# EAGLE schematic TLC5971 (EAGLE 6.4)
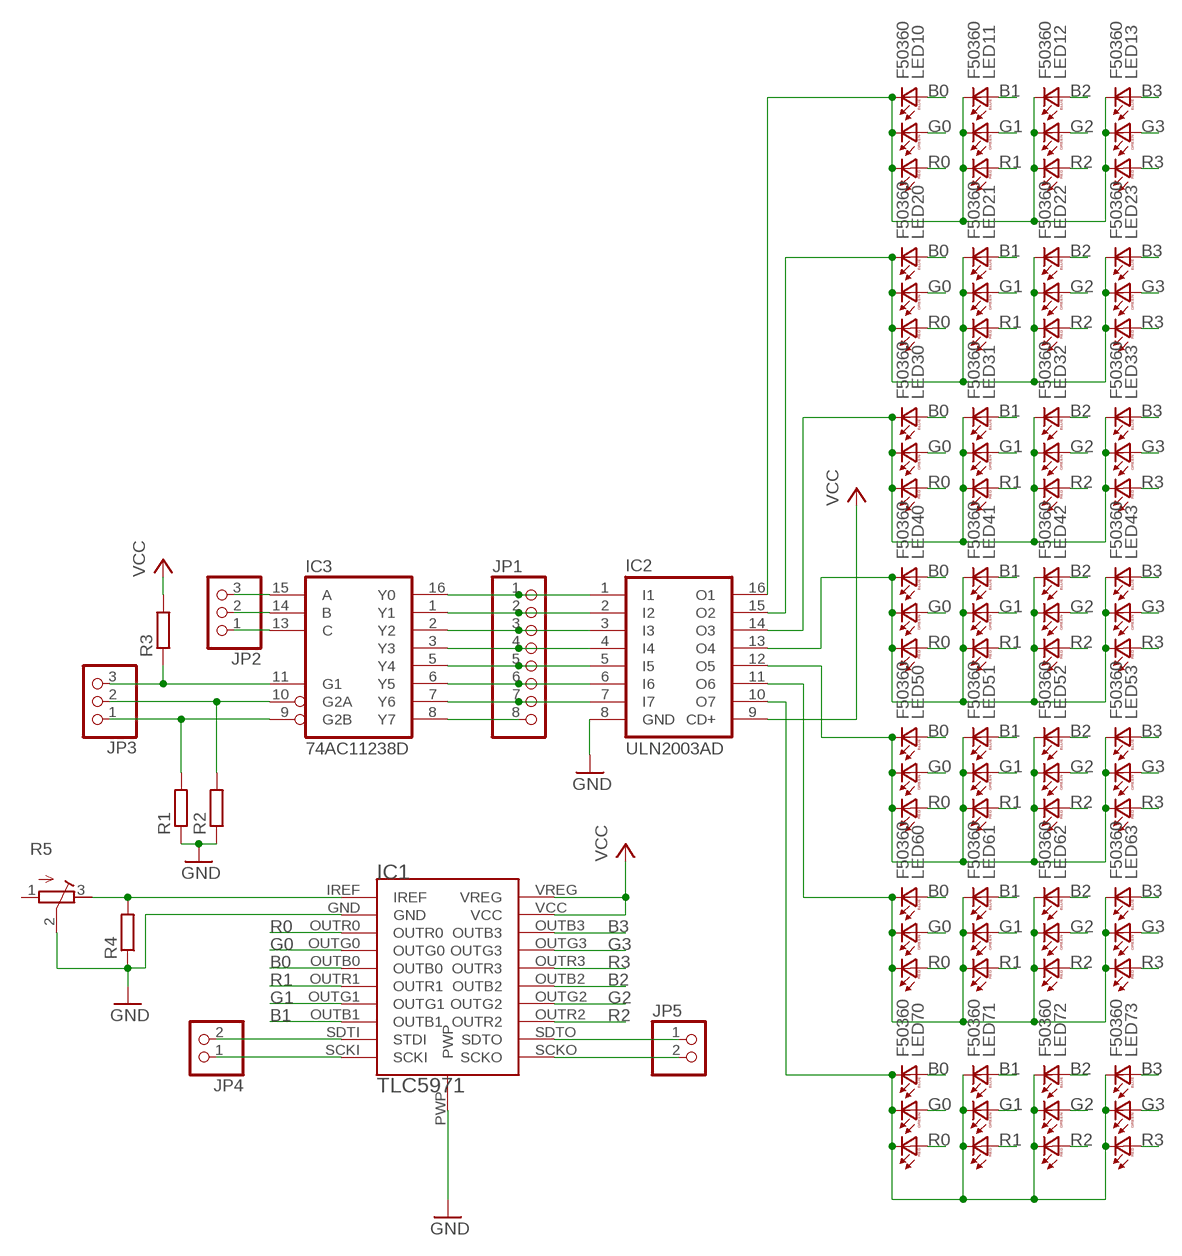
[diagram p0: schematic, sheet 1]

## Parts
IC1  TLC5971  [HTSSOP-20(PWP)]
IC2  ULN2003AD  [SO16]
IC3  74AC11238D  [SO16]
JP1  PINHD-1X8  [1X08]
JP2  PINHD-1X3  [1X03]
JP3  PINHD-1X3  [1X03]
JP4  PINHD-1X2  [1X02]
JP5  PINHD-1X2  [1X02]
LED10  F50360  [F50360]
LED11  F50360  [F50360]
LED12  F50360  [F50360]
LED13  F50360  [F50360]
LED20  F50360  [F50360]
LED21  F50360  [F50360]
LED22  F50360  [F50360]
LED23  F50360  [F50360]
LED30  F50360  [F50360]
LED31  F50360  [F50360]
LED32  F50360  [F50360]
LED33  F50360  [F50360]
LED40  F50360  [F50360]
LED41  F50360  [F50360]
LED42  F50360  [F50360]
LED43  F50360  [F50360]
LED50  F50360  [F50360]
LED51  F50360  [F50360]
LED52  F50360  [F50360]
LED53  F50360  [F50360]
LED60  F50360  [F50360]
LED61  F50360  [F50360]
LED62  F50360  [F50360]
LED63  F50360  [F50360]
LED70  F50360  [F50360]
LED71  F50360  [F50360]
LED72  F50360  [F50360]
LED73  F50360  [F50360]
R1  R-EU_M0805  [M0805]
R2  R-EU_M0805  [M0805]
R3  R-EU_M0805  [M0805]
R4  R-EU_M0805  [M0805]
R5  R-TRIMM74W  [RTRIM74W]

## Nets
B0: IC1.OUTB0 LED10.BA LED20.BA LED30.BA LED40.BA LED50.BA LED60.BA LED70.BA
B1: IC1.OUTB1 LED11.BA LED21.BA LED31.BA LED41.BA LED51.BA LED61.BA LED71.BA
B2: IC1.OUTB2 LED12.BA LED22.BA LED32.BA LED42.BA LED52.BA LED62.BA LED72.BA
B3: IC1.OUTB3 LED13.BA LED23.BA LED33.BA LED43.BA LED53.BA LED63.BA LED73.BA
G0: IC1.OUTG0 LED10.GA LED20.GA LED30.GA LED40.GA LED50.GA LED60.GA LED70.GA
G1: IC1.OUTG1 LED11.GA LED21.GA LED31.GA LED41.GA LED51.GA LED61.GA LED71.GA
G2: IC1.OUTG2 LED12.GA LED22.GA LED32.GA LED42.GA LED52.GA LED62.GA LED72.GA
G3: IC1.OUTG3 LED13.GA LED23.GA LED33.GA LED43.GA LED53.GA LED63.GA LED73.GA
GND: IC1.GND IC1.PWP IC2.8(GND) R1.1 R2.1 R4.1 R5.2(S)
N$1: IC2.1(I1) IC3.16(Y0) JP1.1
N$2: IC2.2(I2) IC3.1(Y1) JP1.2
N$3: IC2.3(I3) IC3.2(Y2) JP1.3
N$4: IC2.4(I4) IC3.3(Y3) JP1.4
N$5: IC2.5(I5) IC3.5(Y4) JP1.5
N$6: IC2.6(I6) IC3.6(Y5) JP1.6
N$7: IC2.7(I7) IC3.7(Y6) JP1.7
N$8: IC3.8(Y7) JP1.8
N$9: IC3.9(G2B) JP3.1 R1.2
N$10: IC3.10(G2A) JP3.2 R2.2
N$11: IC3.11(G1) JP3.3 R3.1
N$12: IC3.15(A) JP2.3
N$13: IC3.14(B) JP2.2
N$14: IC3.13(C) JP2.1
N$15: IC2.12(O5) LED50.BC LED50.GC LED50.RC LED51.BC LED51.GC LED51.RC LED52.BC LED52.GC LED52.RC LED53.BC LED53.GC LED53.RC
N$16: IC2.11(O6) LED60.BC LED60.GC LED60.RC LED61.BC LED61.GC LED61.RC LED62.BC LED62.GC LED62.RC LED63.BC LED63.GC LED63.RC
N$17: IC2.10(O7) LED70.BC LED70.GC LED70.RC LED71.BC LED71.GC LED71.RC LED72.BC LED72.GC LED72.RC LED73.BC LED73.GC LED73.RC
N$18: IC2.13(O4) LED40.BC LED40.GC LED40.RC LED41.BC LED41.GC LED41.RC LED42.BC LED42.GC LED42.RC LED43.BC LED43.GC LED43.RC
N$19: IC2.14(O3) LED30.BC LED30.GC LED30.RC LED31.BC LED31.GC LED31.RC LED32.BC LED32.GC LED32.RC LED33.BC LED33.GC LED33.RC
N$20: IC2.15(O2) LED20.BC LED20.GC LED20.RC LED21.BC LED21.GC LED21.RC LED22.BC LED22.GC LED22.RC LED23.BC LED23.GC LED23.RC
N$21: IC2.16(O1) LED10.BC LED10.GC LED10.RC LED11.BC LED11.GC LED11.RC LED12.BC LED12.GC LED12.RC LED13.BC LED13.GC LED13.RC
N$22: IC1.SDTI(STDI) JP4.2
N$23: IC1.SCKI JP4.1
N$24: IC1.SCKO JP5.2
N$25: IC1.SDTO JP5.1
N$26: IC1.IREF R4.2 R5.3(E)
R0: IC1.OUTR0 LED10.RA LED20.RA LED30.RA LED40.RA LED50.RA LED60.RA LED70.RA
R1: IC1.OUTR1 LED11.RA LED21.RA LED31.RA LED41.RA LED51.RA LED61.RA LED71.RA
R2: IC1.OUTR2 LED12.RA LED22.RA LED32.RA LED42.RA LED52.RA LED62.RA LED72.RA
R3: IC1.OUTR3 LED13.RA LED23.RA LED33.RA LED43.RA LED53.RA LED63.RA LED73.RA
VCC: IC1.VCC IC1.VREG IC2.9(CD+) R3.2
Unconnected: R5.1(A)

## Power pins joined to a net without a drawn wire
GND: IC3.4(GND)
VCC: IC3.12(VCC)

## Library data of the parts
IC1 = BEEP:TLC5971
IC2 = uln-udn:ULN2003A: DRIVER ARRAY
IC3 = 74ac-logic:74AC11238: 3 to 8 line DECODER/DEMULTIPLEXER
JP1 = pinhead:PINHD-1X8: PIN HEADER
JP2 JP3 = pinhead:PINHD-1X3: PIN HEADER
JP4 JP5 = pinhead:PINHD-1X2: PIN HEADER
LED10-LED13 LED20-LED23 LED30-LED33 LED40-LED43 LED50-LED53 LED60-LED63 LED70-LED73 = led:F50360: Full color Z-Power LED RGB P5-II Series Source: http://www.seoulsemicon.co.kr .. F50360.pdf
R1-R4 = rcl:R-EU_: RESISTOR, European symbol
R5 = rcl:R-TRIMM: Trimm resistor